# EAGLE design CC1101-E07-PI (EAGLE 7.7.0)
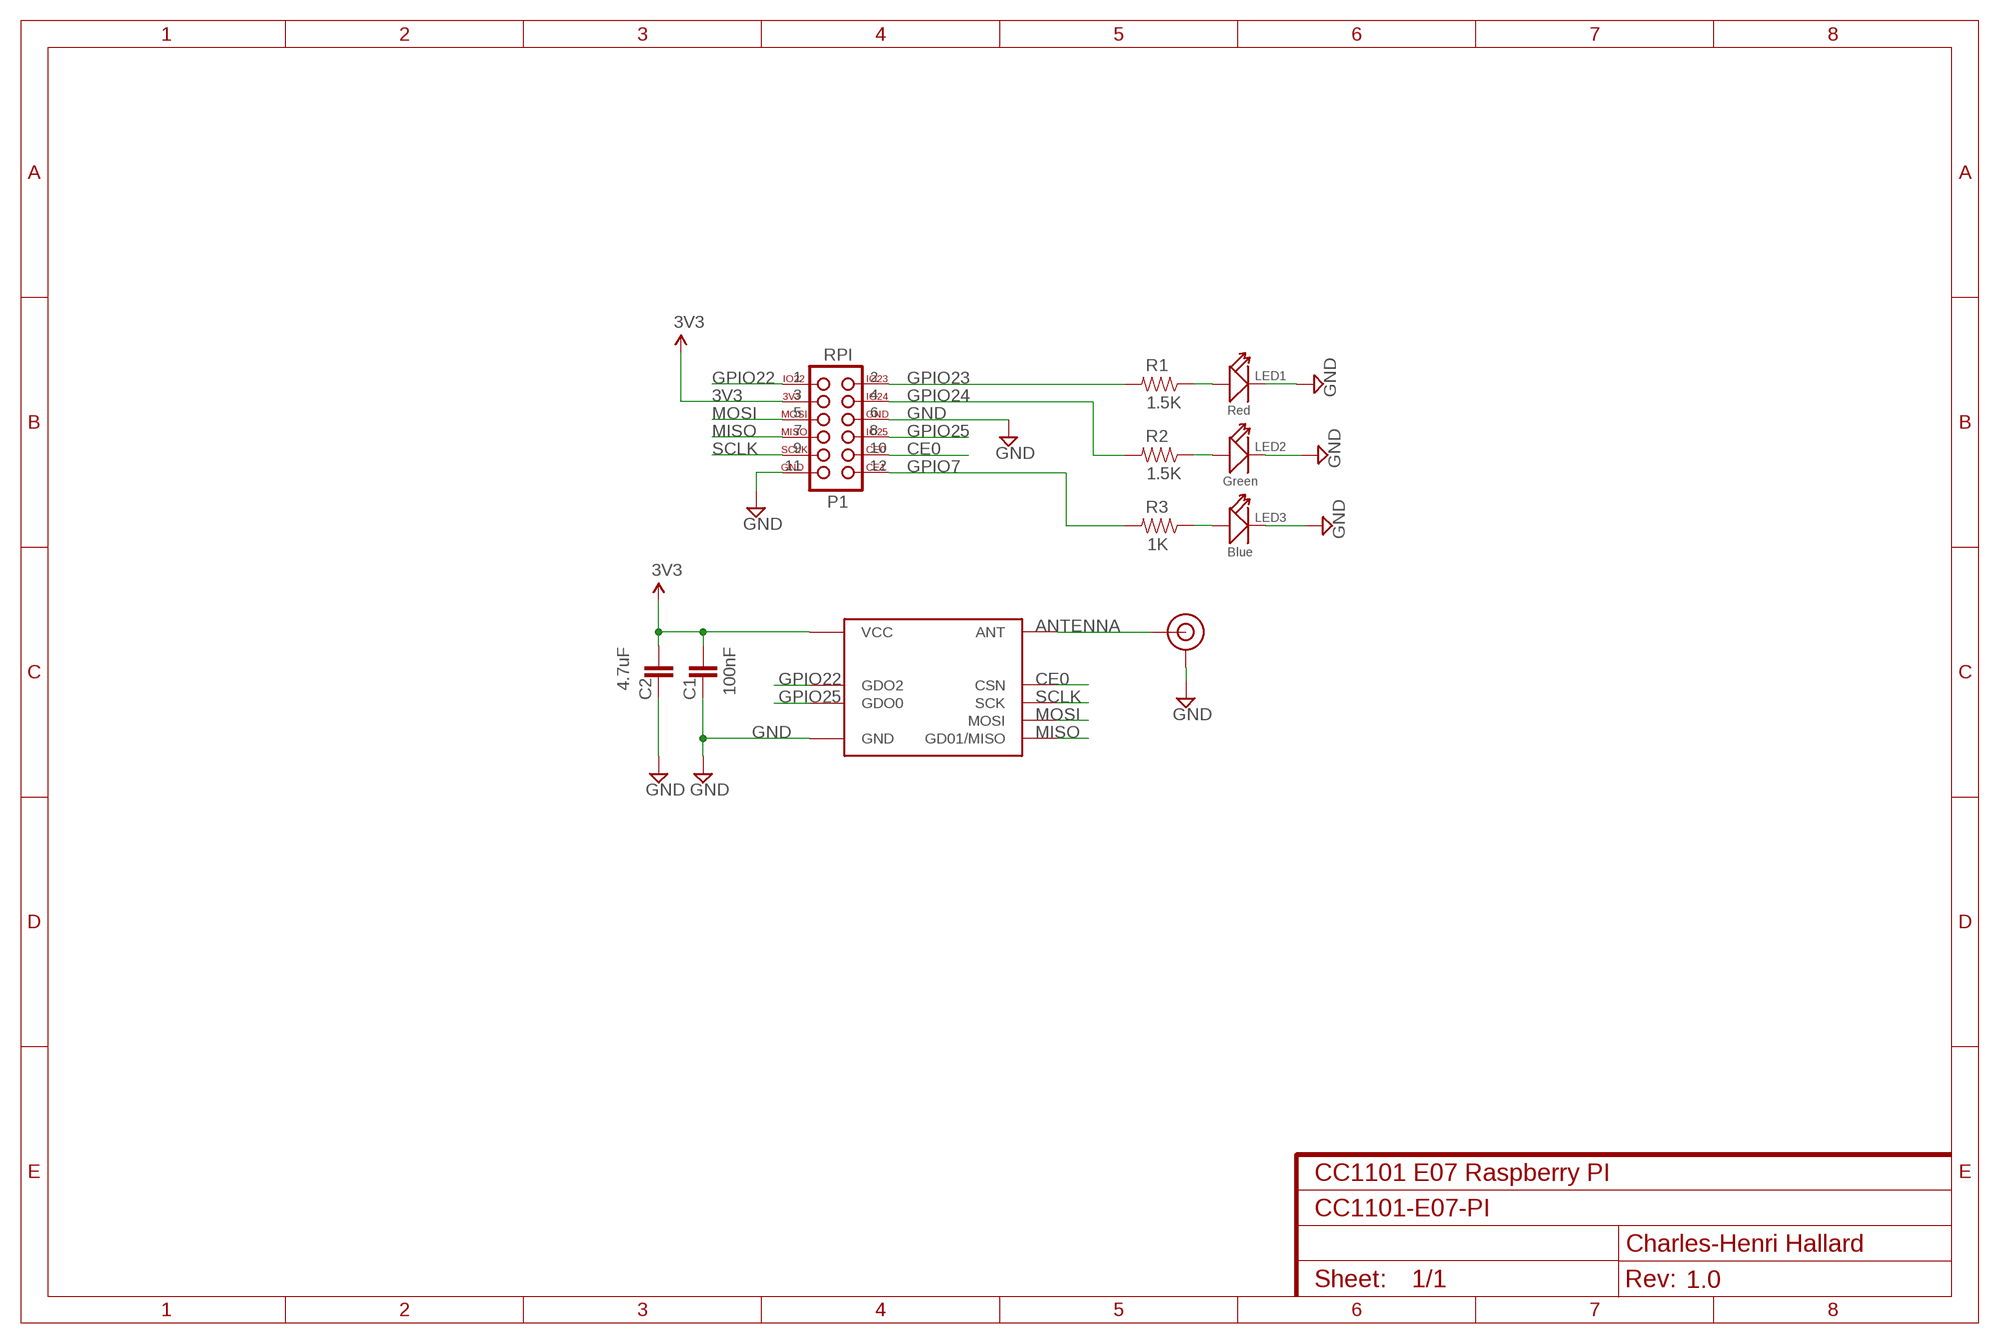
[diagram p0: schematic, sheet 1]
NAME (FRAME-A4L): CNAME: CC1101 E07 Raspberry PI; CREVISION: 1.0; DESIGNER: Charles-Henri Hallard

## Parts
C1  100nF  CAP0402-CAP  [0402-CAP]
C2  4.7uF  CAP0402-CAP  [0402-CAP]
J1  2X6_BOTTOM  RASPBERRY_PI_2X6_BOTTOM  [2X06]
J$1  ANTENNASMA  [SMA_PAD]
LED1  Red  SMD-LED-CLEAR-BLUE(0402)  [LED-0402]
LED2  Green  SMD-LED-CLEAR-BLUE(0402)  [LED-0402]
LED3  Blue  SMD-LED-CLEAR-BLUE(0402)  [LED-0402]
R1  1.5K  RESISTOR0402-RES  [0402-RES]
R2  1.5K  RESISTOR0402-RES  [0402-RES]
R3  1K  RESISTOR0402-RES  [0402-RES]
U1  E07-400M10S  E07-900M10S  [E07-900M10S]

## Nets
3V3: C1.2 C2.2 J1.3 U1.9(VCC)
ANTENNA: J$1.ANT0(ANT) J$1.ANT1(ANT) J$1.ANT2(ANT) U1.21(ANT)
CE0: J1.10 U1.19(CSN)
GND: C1.1 C2.1 J1.6 J1.11 J$1.GND3(GND) J$1.GND4(GND) J$1.GND5(GND) J$1.GND6(GND) LED1.- LED2.- LED3.- U1.1(GND) U1.2(GND) U1.3(GND) U1.4(GND) U1.5(GND) U1.11(GND) U1.12(GND) U1.20(GND) U1.22(GND)
GPIO7: J1.12 R3.2
GPIO22: J1.1 U1.14(GDO2)
GPIO23: J1.2 R1.2
GPIO24: J1.4 R2.2
GPIO25: J1.8 U1.15(GDO0)
MISO: J1.7 U1.16(GD01/MISO)
MOSI: J1.5 U1.17(MOSI)
N$1: LED1.+ R1.1
N$2: LED2.+ R2.1
N$3: LED3.+ R3.1
SCLK: J1.9 U1.18(SCK)

## Library data of the parts
C1 C2 = _c2h:CAP: Capacitor Standard 0603 ceramic capacitor, and 0.1" leaded capacitor.
J1 = _c2h:RASPBERRY_PI_2X6_BOTTOM
J$1 = _c2h:ANTENNA: SMA Antenna Connector End launch SMA connector. The paste layer has been removed so that the connector can be hand soldered onto the board after reflow.
LED1-LED3 = OPL_Optoelectronics:SMD-LED-CLEAR-BLUE(0402): 304090075; MPN: BL-HB337A-AV-TRB; VALUE: BLUE-0402
R1-R3 = _c2h:RESISTOR: Resistor Basic schematic elements and footprints for 0603, 1206, and PTH resistors.
U1 = E07-400M10S:E07-900M10S

## Board
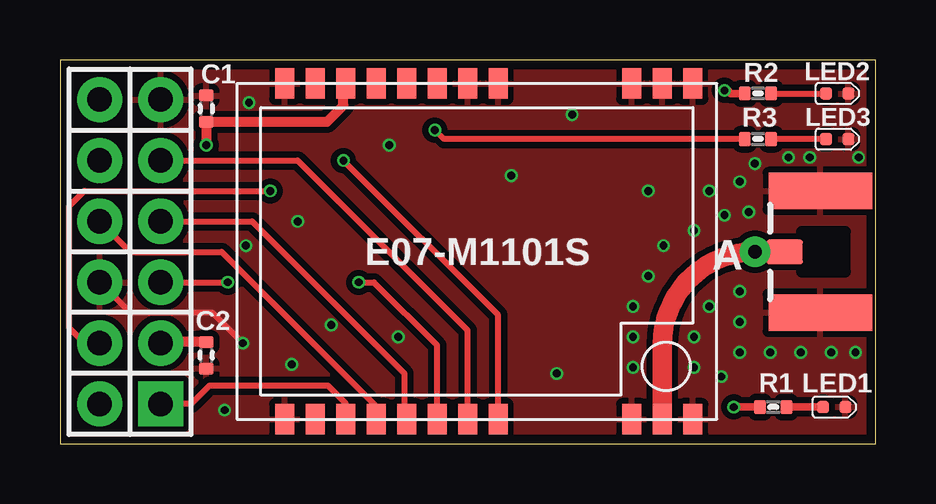
[diagram p1: board, top side]
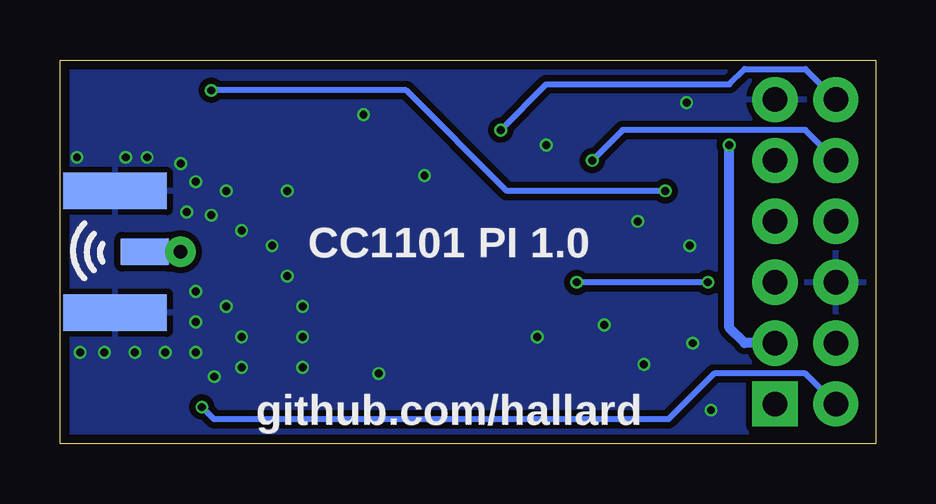
[diagram p2: board, bottom side, seen from below]

Size 33.98 x 16 mm. Coordinates in mm from the lower left corner, seen from the top.
Outline: 0,0 33.98,0 33.98,16 0,16 0,0
Copper layers (1*16): Top 0.035559375mm / dielectric 0.17018125mm / Bottom 0.035559375mm
Design rules "oshpark-4layer-tented *": minimum track width 5mil, minimum drill 10mil, track to track 5mil, track to pad 5mil, pad to pad 5mil, via to via 5mil, smd to smd 5mil, copper to edge 15mil, drill to drill 6mil, minimum pad ring 4mil, minimum via ring 4mil, stop-mask expansion 1.5mil, vias tented up to drill 20mil, thermal gap 10mil

### Footprints (pad centres in the part's own frame; a part is rotated, then mirrored left to right if it is on the bottom)
0402-CAP = smd 0.5 x 0.6: 1 -0.55,0; 2 0.55,0
2X06 = drill 1.016 pad 1.88 square: 1 -6.35,-1.27 | drill 1.016 pad 1.88: 2 -6.35,1.27; 3 -3.81,-1.27; 4 -3.81,1.27; 5 -1.27,-1.27; 6 -1.27,1.27; 7 1.27,-1.27; 8 1.27,1.27; 9 3.81,-1.27; 10 3.81,1.27; 11 6.35,-1.27; 12 6.35,1.27
SMA_PAD = smd 2.032 x 1.143 bottom: ANT0 -1.049,0 | smd 1.524 x 1.016: ANT1 -1.303,0 | drill 0.559 pad 1.27: ANT2 -2.54,0 | smd 4.318 x 1.524: GND3 0.191,-2.54; GND4 0.191,2.54 | smd 4.318 x 1.524 bottom: GND5 0.191,2.54; GND6 0.191,-2.54
LED-0402 = smd 0.5 x 0.5: + -0.463,0; - 0.463,0
0402-RES = smd 0.5 x 0.6: 1 -0.55,0; 2 0.55,0
E07-900M10S = smd 0.8 x 1.27: 1 19,14; 2 17.73,14; 3 16.46,14; 4 10.89,14; 5 9.62,14; 6 8.35,14; 7 7.08,14; 8 5.81,14; 9 4.54,14; 10 3.27,14; 11 2,14; 12 2,0; 13 3.27,0; 14 4.54,0; 15 5.81,0; 16 7.08,0; 17 8.35,0; 18 9.62,0; 19 10.89,0; 20 16.46,0; 21 17.73,0; 22 19,0

### Placement (x,y rotation side)
C1  6.1,13.97 270 top
C2  6.1,3.68 90 top
J1  2.92,8 90 top
J$1  31.5,8 0 top
LED1  32.26,1.52 0 top
LED2  32.38,14.61 0 top
LED3  32.38,12.7 0 top
R1  29.72,1.52 180 top
R2  29.08,14.61 180 top
R3  29.08,12.7 180 top
U1  7.37,1.02 0 top

### Tracks (layer width: path | path; a pad name or v marks a point on that pad's centre or on a via)
3V3  (via drill 0.33)
  Top 0.406: C2.2 4.23,4.23 J1.3 | v6.1,12.45 C1.2 11.13,13.42 11.81,14.1 11.81,14.92 U1.9
  Bottom 0.406: J1.3 5.46,4.19 6.1,4.83 v6.1,12.45
ANTENNA
  Top 0.813: J$1.ANT1 J$1.ANT2 arc90 25.1,4.14 U1.21
  Bottom 0.406: J$1.ANT0 J$1.ANT2
CE0  (via drill 0.33)
  Top 0.254: U1.19 18.26,5.37 v11.81,11.81
  Bottom 0.254: J1.10 2.92,13.08 10.54,13.08 v11.81,11.81
GND  (via drill 0.33)
  Top 0.254: J1.6 2.92,5.46 6.35,5.46 v7.62,4.19
  other vias: 9.91,9.27 18.8,11.18 9.65,3.3 14.1,4.45 23.88,3.17 23.88,4.45 23.88,5.71 24.51,6.98 25.15,8.25 26.42,8.89 27.69,9.52 26.42,3.17 26.42,4.45 27.05,5.71 28.32,6.35 28.32,5.08 28.32,3.81 29.59,3.81 30.86,3.81 32.13,3.81 28.7,9.65 28.32,10.92 30.35,11.94 31.24,11.94 33.27,11.94 7.87,14.22 6.86,1.4 11.3,4.95 27.05,10.54 27.56,2.79 7.75,8.25 28.96,11.68 13.72,12.45 33.15,3.81 21.34,13.72 24.51,10.54 20.7,2.92
  pour Bottom (isolate 0.254): -0.89,16.89 35.31,16.89 35.31,-0.89 -0.89,-0.89
  pour Top (isolate 0.254): -0.25,16.26 34.67,16.26 34.67,-0.25 -0.25,-0.25
GPIO7  (via drill 0.33)
  Top 0.254: R3.2 16,12.7 v15.62,13.08
  Bottom 0.254: v15.62,13.08 13.72,14.99 6.1,14.99 5.46,15.62 2.92,15.62 J1.12
GPIO22
  Top 0.254: U1.14 11.91,1.68 11.18,2.41 6.22,2.41 5.46,1.65 J1.1
GPIO23  (via drill 0.33)
  Top 0.305: R1.2 v28.07,1.52
  Bottom 0.254: v28.07,1.52 27.56,1.02 8.64,1.02 6.73,2.92 2.92,2.92 J1.2
GPIO24  (via drill 0.33)
  Top 0.254: J1.4 1.02,4.19 0.38,4.83 0.38,9.91 1.02,10.54 v8.76,10.54
  Top 0.305: v27.69,14.73 27.81,14.73 27.94,14.61 R2.2
  Bottom 0.254: v27.69,14.73 19.56,14.73 15.37,10.54 v8.76,10.54
GPIO25
  Top 0.254: U1.15 13.21,1.05 13.21,1.52 6.73,8 2.92,8 J1.8
MISO
  Top 0.254: J1.7 8,9.27 14.35,2.92 14.35,1.11 U1.16
MOSI  (via drill 0.33)
  Top 0.254: U1.17 15.72,4.1 13.08,6.73 v12.45,6.73 | J1.5 v6.99,6.73
  Bottom 0.254: v6.99,6.73 v12.45,6.73
N$1
  Top 0.305: R1.1 LED1.+
N$2
  Top 0.254: R2.1 LED2.+
N$3
  Top 0.254: LED3.+ R3.1
SCLK
  Top 0.254: U1.18 16.99,4.73 9.91,11.81 J1.9

### Text on the board
tPlace: E07-M1101S | A
bPlace: CC1101 PI 1.0 | github.com/hallard